# EAGLE schematic interfacing (EAGLE 7.6.0)
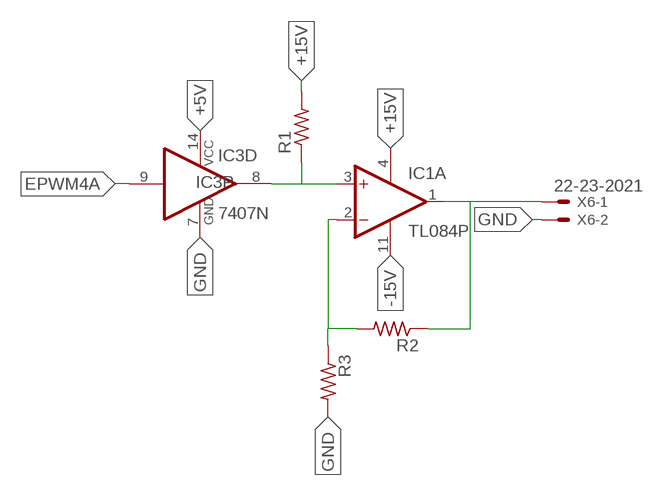
[diagram p0: schematic, sheet 1]

## Parts
IC1  TL084P  [DIL14]
IC3  7407N  [DIL14]
R1  R-US_0207/10  [0207/10]
R2  R-US_0207/10  [0207/10]
R3  R-US_0207/10  [0207/10]
X6  22-23-2021  [22-23-2021]

## Nets
+5V: IC3.14(P:VCC)
+15V: IC1.4(P:V+) R1.2
-15V: IC1.11(P:V-)
EPWM4A: IC3.9(D:I)
GND: IC3.7(P:GND) R3.2 X6.2
N$4: IC1.2(A:-IN) R2.2 R3.1
N$5: IC1.1(A:OUT) R2.1 X6.1
N$6: IC1.3(A:+IN) IC3.8(D:O) R1.1
Unconnected: IC1.5(B:+IN) IC1.6(B:-IN) IC1.7(B:OUT) IC1.8(C:OUT) IC1.9(C:-IN) IC1.10(C:+IN) IC1.12(D:+IN) IC1.13(D:-IN) IC1.14(D:OUT) IC3.1(A:I) IC3.2(A:O) IC3.3(B:I) IC3.4(B:O) IC3.5(C:I) IC3.6(C:O) IC3.10(E:O) IC3.11(E:I) IC3.12(F:O) IC3.13(F:I)

## Library data of the parts
IC1 = linear:TL084: OP AMP
IC3 = 74xx-eu:74*07: Hex BUFFER, open collector high-voltage output
R1-R3 = rcl:R-US_: RESISTOR, American symbol
X6 = con-molex:22-23-2021: .100" (2.54mm) Center Header - 2 Pin; MF: MOLEX; MPN: 22-23-2021; OC_FARNELL: 1462926; OC_NEWARK: 25C3832